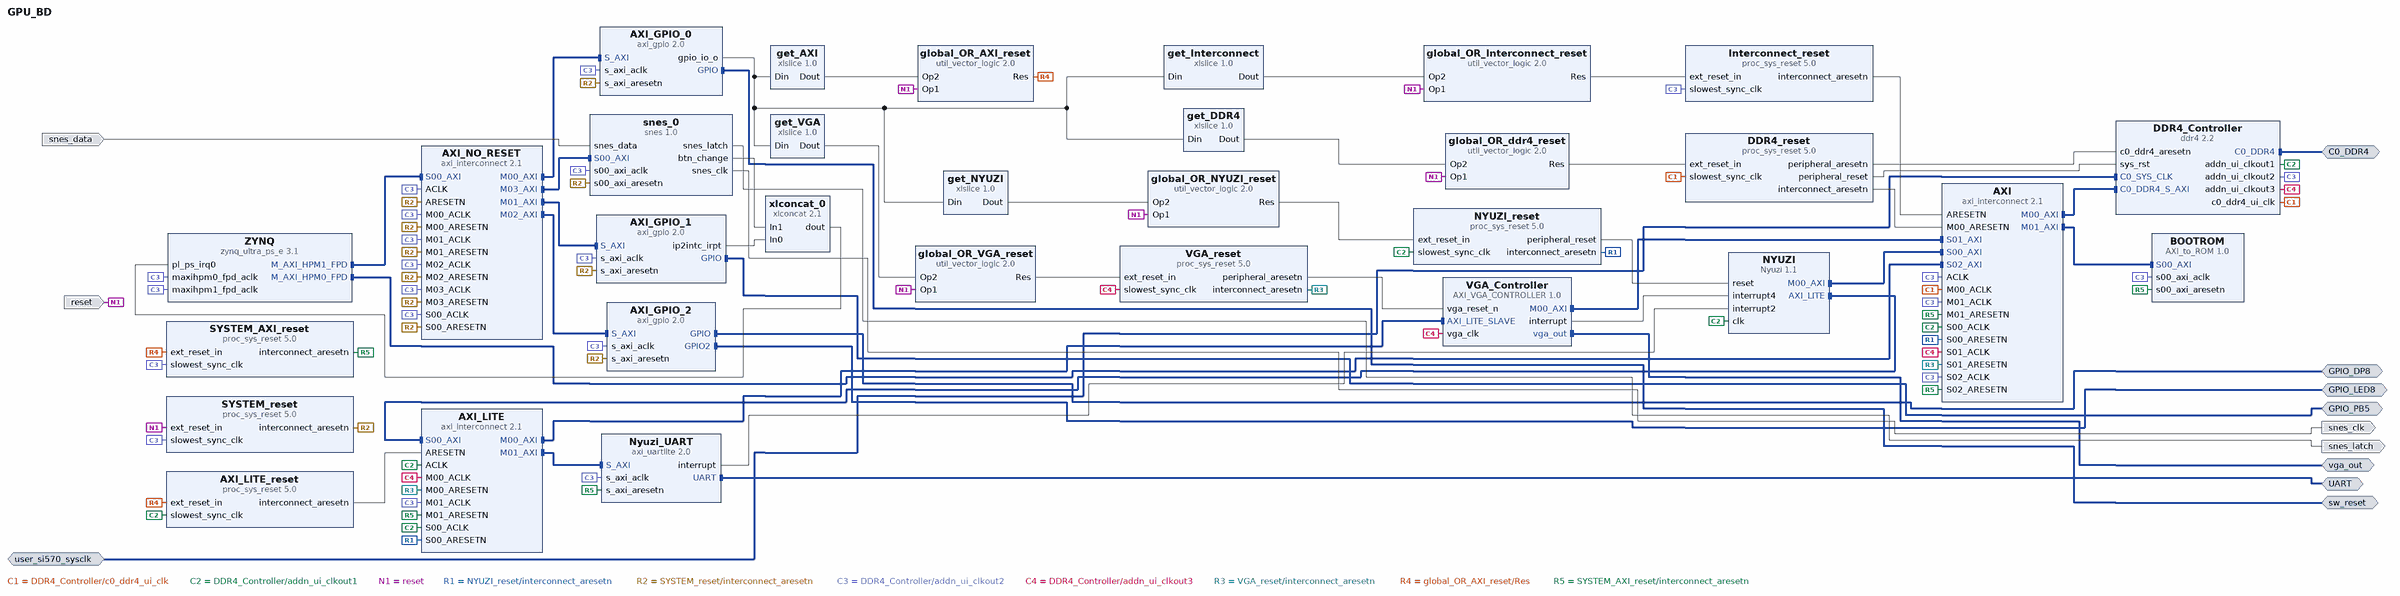
[diagram p0: block diagram of the top level]
# Vivado block design GPU_BD, xczu9eg-ffvb1156-2-e, Vivado 2017.4
create_bd_design GPU_BD

create_bd_intf_port -mode Slave -vlnv xilinx.com:interface:diff_clock_rtl:1.0 user_si570_sysclk
set_property -dict {CONFIG.FREQ_HZ 300000000} [get_bd_intf_ports user_si570_sysclk]
create_bd_intf_port -mode Master -vlnv xilinx.com:interface:ddr4_rtl:1.0 C0_DDR4
create_bd_intf_port -mode Master -vlnv user.org:interface:vga_out_rtl:1.0 vga_out
create_bd_intf_port -mode Master -vlnv xilinx.com:interface:uart_rtl:1.0 UART
create_bd_intf_port -mode Master -vlnv xilinx.com:interface:gpio_rtl:1.0 GPIO_PB5
create_bd_intf_port -mode Master -vlnv xilinx.com:interface:gpio_rtl:1.0 GPIO_DP8
create_bd_intf_port -mode Master -vlnv xilinx.com:interface:gpio_rtl:1.0 GPIO_LED8
create_bd_intf_port -mode Master -vlnv xilinx.com:interface:gpio_rtl:1.0 sw_reset
create_bd_port -dir I -type rst reset
set_property -dict {CONFIG.POLARITY ACTIVE_HIGH} [get_bd_ports reset]
create_bd_port -dir O snes_latch
create_bd_port -dir O snes_clk
create_bd_port -dir I snes_data

create_bd_cell -type ip -vlnv xilinx.com:ip:zynq_ultra_ps_e:3.1 ZYNQ
set_property -dict [list \
  CONFIG.PSU__PSS_REF_CLK__FREQMHZ 33.330 \
  CONFIG.PSU__CAN1__PERIPHERAL__ENABLE 1 \
  CONFIG.PSU__CAN1__PERIPHERAL__IO {MIO 24 .. 25} \
  CONFIG.PSU__DPAUX__PERIPHERAL__ENABLE 1 \
  CONFIG.PSU__DPAUX__PERIPHERAL__IO {MIO 27 .. 30} \
  CONFIG.PSU__GEM__TSU__ENABLE 0 \
  CONFIG.PSU__FPGA_PL0_ENABLE 1 \
  CONFIG.PSU__ENET3__PERIPHERAL__ENABLE 1 \
  CONFIG.PSU__ENET3__FIFO__ENABLE 0 \
  CONFIG.PSU__ENET3__PTP__ENABLE 0 \
  CONFIG.PSU__ENET3__PERIPHERAL__IO {MIO 64 .. 75} \
  CONFIG.PSU__ENET3__GRP_MDIO__ENABLE 1 \
  CONFIG.PSU__ENET3__GRP_MDIO__IO {MIO 76 .. 77} \
  CONFIG.PSU__GPIO0_MIO__PERIPHERAL__ENABLE 1 \
  CONFIG.PSU__GPIO0_MIO__IO {MIO 0 .. 25} \
  CONFIG.PSU__GPIO1_MIO__PERIPHERAL__ENABLE 1 \
  CONFIG.PSU__GPIO1_MIO__IO {MIO 26 .. 51} \
  CONFIG.PSU__I2C0__PERIPHERAL__ENABLE 1 \
  CONFIG.PSU__I2C0__PERIPHERAL__IO {MIO 14 .. 15} \
  CONFIG.PSU__I2C1__PERIPHERAL__ENABLE 1 \
  CONFIG.PSU__I2C1__PERIPHERAL__IO {MIO 16 .. 17} \
  CONFIG.PSU__PCIE__PERIPHERAL__ENABLE 1 \
  CONFIG.PSU__PCIE__PERIPHERAL__ENDPOINT_ENABLE 0 \
  CONFIG.PSU__PCIE__PERIPHERAL__ROOTPORT_ENABLE 1 \
  CONFIG.PSU__PCIE__PERIPHERAL__ROOTPORT_IO {MIO 31} \
  CONFIG.PSU__PCIE__LANE0__ENABLE 1 \
  CONFIG.PSU__PCIE__LANE0__IO {GT Lane0} \
  CONFIG.PSU__GT__LINK_SPEED HBR \
  CONFIG.PSU__GT__VLT_SWNG_LVL_4 0 \
  CONFIG.PSU__GT__PRE_EMPH_LVL_4 0 \
  CONFIG.PSU__USB0__REF_CLK_SEL {Ref Clk2} \
  CONFIG.PSU__USB0__REF_CLK_FREQ 26 \
  CONFIG.PSU__DP__REF_CLK_SEL {Ref Clk3} \
  CONFIG.PSU__DP__REF_CLK_FREQ 27 \
  CONFIG.PSU__SATA__REF_CLK_SEL {Ref Clk1} \
  CONFIG.PSU__SATA__REF_CLK_FREQ 125 \
  CONFIG.PSU__PCIE__REF_CLK_SEL {Ref Clk0} \
  CONFIG.PSU__PCIE__REF_CLK_FREQ 100 \
  CONFIG.PSU__DP__LANE_SEL {Single Lower} \
  CONFIG.PSU__PCIE__DEVICE_PORT_TYPE {Root Port} \
  CONFIG.PSU__PCIE__MAXIMUM_LINK_WIDTH x1 \
  CONFIG.PSU__PCIE__LINK_SPEED {5.0 Gb/s} \
  CONFIG.PSU__PCIE__BAR0_VAL 0x0 \
  CONFIG.PSU__PCIE__BAR1_VAL 0x0 \
  CONFIG.PSU__PCIE__BAR2_VAL 0x0 \
  CONFIG.PSU__PCIE__BAR3_VAL 0x0 \
  CONFIG.PSU__PCIE__BAR4_VAL 0x0 \
  CONFIG.PSU__PCIE__BAR5_VAL 0x0 \
  CONFIG.PSU__PCIE__EROM_VAL 0x0 \
  CONFIG.PSU__PCIE__MAX_PAYLOAD_SIZE {256 bytes} \
  CONFIG.PSU__PCIE__VENDOR_ID 0x10EE \
  CONFIG.PSU__PCIE__DEVICE_ID 0xD021 \
  CONFIG.PSU__PCIE__REVISION_ID 0x0 \
  CONFIG.PSU__PCIE__SUBSYSTEM_VENDOR_ID 0x10EE \
  CONFIG.PSU__PCIE__SUBSYSTEM_ID 0x7 \
  CONFIG.PSU__PCIE__CLASS_CODE_BASE 0x06 \
  CONFIG.PSU__PCIE__CLASS_CODE_SUB 0x4 \
  CONFIG.PSU__PCIE__CLASS_CODE_INTERFACE 0x0 \
  CONFIG.PSU__PCIE__CLASS_CODE_VALUE 0x60400 \
  CONFIG.PSU__PCIE__CRS_SW_VISIBILITY 1 \
  CONFIG.PSU__PMU__AIBACK__ENABLE 0 \
  CONFIG.PSU__PMU__PLERROR__ENABLE 0 \
  CONFIG.PSU__PMU__PERIPHERAL__ENABLE 1 \
  CONFIG.PSU__PMU__EMIO_GPI__ENABLE 0 \
  CONFIG.PSU__PMU__EMIO_GPO__ENABLE 0 \
  CONFIG.PSU__PMU__GPI0__ENABLE 0 \
  CONFIG.PSU__PMU__GPI1__ENABLE 0 \
  CONFIG.PSU__PMU__GPI2__ENABLE 0 \
  CONFIG.PSU__PMU__GPI3__ENABLE 0 \
  CONFIG.PSU__PMU__GPI4__ENABLE 0 \
  CONFIG.PSU__PMU__GPI5__ENABLE 0 \
  CONFIG.PSU__PMU__GPO0__ENABLE 0 \
  CONFIG.PSU__PMU__GPO1__ENABLE 0 \
  CONFIG.PSU__PMU__GPO2__ENABLE 0 \
  CONFIG.PSU__PMU__GPO3__ENABLE 0 \
  CONFIG.PSU__PMU__GPO4__ENABLE 0 \
  CONFIG.PSU__PMU__GPO5__ENABLE 0 \
  CONFIG.PSU__QSPI__PERIPHERAL__ENABLE 1 \
  CONFIG.PSU__QSPI__PERIPHERAL__IO {MIO 0 .. 12} \
  CONFIG.PSU__QSPI__PERIPHERAL__MODE {Dual Parallel} \
  CONFIG.PSU__QSPI__PERIPHERAL__DATA_MODE x4 \
  CONFIG.PSU__QSPI__GRP_FBCLK__ENABLE 1 \
  CONFIG.PSU__QSPI__GRP_FBCLK__IO {MIO 6} \
  CONFIG.PSU__SD1__PERIPHERAL__ENABLE 1 \
  CONFIG.PSU__SD1__PERIPHERAL__IO {MIO 39 .. 51} \
  CONFIG.PSU__SD1__GRP_CD__ENABLE 1 \
  CONFIG.PSU__SD1__GRP_CD__IO {MIO 45} \
  CONFIG.PSU__SD1__GRP_POW__ENABLE 0 \
  CONFIG.PSU__SD1__GRP_WP__ENABLE 1 \
  CONFIG.PSU__SD1__GRP_WP__IO {MIO 44} \
  CONFIG.PSU__SD1__SLOT_TYPE {SD 3.0} \
  CONFIG.PSU__SD1__DATA_TRANSFER_MODE 8Bit \
  CONFIG.PSU__SWDT0__PERIPHERAL__ENABLE 1 \
  CONFIG.PSU__SWDT0__CLOCK__ENABLE 0 \
  CONFIG.PSU__SWDT0__RESET__ENABLE 0 \
  CONFIG.PSU__SWDT1__PERIPHERAL__ENABLE 1 \
  CONFIG.PSU__SWDT1__CLOCK__ENABLE 0 \
  CONFIG.PSU__SWDT1__RESET__ENABLE 0 \
  CONFIG.PSU__UART0__BAUD_RATE 115200 \
  CONFIG.PSU__TTC0__PERIPHERAL__ENABLE 1 \
  CONFIG.PSU__TTC0__CLOCK__ENABLE 0 \
  CONFIG.PSU__TTC0__WAVEOUT__ENABLE 0 \
  CONFIG.PSU__TTC1__PERIPHERAL__ENABLE 1 \
  CONFIG.PSU__UART1__BAUD_RATE 115200 \
  CONFIG.PSU__TTC1__CLOCK__ENABLE 0 \
  CONFIG.PSU__TTC1__WAVEOUT__ENABLE 0 \
  CONFIG.PSU__TTC2__PERIPHERAL__ENABLE 1 \
  CONFIG.PSU__TTC2__CLOCK__ENABLE 0 \
  CONFIG.PSU__TTC2__WAVEOUT__ENABLE 0 \
  CONFIG.PSU__TTC3__PERIPHERAL__ENABLE 1 \
  CONFIG.PSU__TTC3__CLOCK__ENABLE 0 \
  CONFIG.PSU__TTC3__WAVEOUT__ENABLE 0 \
  CONFIG.PSU__CSUPMU__PERIPHERAL__VALID 1 \
  CONFIG.PSU__DDRC__BUS_WIDTH {64 Bit} \
  CONFIG.PSU__DDRC__DEVICE_CAPACITY {4096 MBits} \
  CONFIG.PSU__DDRC__DRAM_WIDTH {8 Bits} \
  CONFIG.PSU__DDRC__ECC Disabled \
  CONFIG.PSU__DDRC__MEMORY_TYPE {DDR 4} \
  CONFIG.PSU__DDRC__SPEED_BIN DDR4_2133P \
  CONFIG.PSU__DDRC__COMPONENTS UDIMM \
  CONFIG.PSU__UART0__PERIPHERAL__ENABLE 1 \
  CONFIG.PSU__UART0__PERIPHERAL__IO {MIO 18 .. 19} \
  CONFIG.PSU__UART0__MODEM__ENABLE 0 \
  CONFIG.PSU__UART1__PERIPHERAL__ENABLE 1 \
  CONFIG.PSU__UART1__PERIPHERAL__IO {MIO 20 .. 21} \
  CONFIG.PSU__UART1__MODEM__ENABLE 0 \
  CONFIG.PSU__USB0__PERIPHERAL__ENABLE 1 \
  CONFIG.PSU__USB0__PERIPHERAL__IO {MIO 52 .. 63} \
  CONFIG.PSU__USB3_0__PERIPHERAL__ENABLE 1 \
  CONFIG.PSU__USB3_0__PERIPHERAL__IO {GT Lane2} \
  CONFIG.PSU__USB3_0__EMIO__ENABLE 0 \
  CONFIG.PSU__USB2_0__EMIO__ENABLE 0 \
  CONFIG.PSU__USE__M_AXI_GP0 1 \
  CONFIG.PSU__MAXIGP0__DATA_WIDTH 128 \
  CONFIG.PSU__USE__M_AXI_GP1 1 \
  CONFIG.PSU__USE__M_AXI_GP2 0 \
  CONFIG.PSU__USE__IRQ0 1 \
  CONFIG.PSU__USE__FABRIC__RST 0 \
  CONFIG.PSU__PRESET_APPLIED 1 \
  CONFIG.PSU__DDR_HIGH_ADDRESS_GUI_ENABLE 1 \
  CONFIG.PSU_BANK_0_IO_STANDARD LVCMOS18 \
  CONFIG.PSU_BANK_1_IO_STANDARD LVCMOS18 \
  CONFIG.PSU_BANK_2_IO_STANDARD LVCMOS18 \
  CONFIG.PSU__DISPLAYPORT__PERIPHERAL__ENABLE 1 \
  CONFIG.PSU__DISPLAYPORT__LANE0__ENABLE 1 \
  CONFIG.PSU__DISPLAYPORT__LANE0__IO {GT Lane1} \
  CONFIG.PSU__DISPLAYPORT__LANE1__ENABLE 0 \
  CONFIG.PSU__SATA__PERIPHERAL__ENABLE 1 \
  CONFIG.PSU__SATA__LANE1__IO {GT Lane3} \
  CONFIG.PSU__CRL_APB__USB3__ENABLE 1 \
  CONFIG.PSU__CRF_APB__APLL_CTRL__SRCSEL PSS_REF_CLK \
  CONFIG.PSU__CRF_APB__DPLL_CTRL__SRCSEL PSS_REF_CLK \
  CONFIG.PSU__CRF_APB__VPLL_CTRL__SRCSEL PSS_REF_CLK \
  CONFIG.PSU__CRF_APB__ACPU_CTRL__SRCSEL APLL \
  CONFIG.PSU__CRF_APB__DBG_TRACE_CTRL__SRCSEL IOPLL \
  CONFIG.PSU__CRF_APB__DBG_FPD_CTRL__SRCSEL IOPLL \
  CONFIG.PSU__CRF_APB__DP_VIDEO_REF_CTRL__SRCSEL VPLL \
  CONFIG.PSU__CRF_APB__DP_AUDIO_REF_CTRL__SRCSEL RPLL \
  CONFIG.PSU__CRF_APB__DP_STC_REF_CTRL__SRCSEL RPLL \
  CONFIG.PSU__CRF_APB__DDR_CTRL__SRCSEL DPLL \
  CONFIG.PSU__CRF_APB__GPU_REF_CTRL__SRCSEL IOPLL \
  CONFIG.PSU__CRL_APB__PL0_REF_CTRL__SRCSEL IOPLL \
  CONFIG.PSU__CRF_APB__GDMA_REF_CTRL__SRCSEL APLL \
  CONFIG.PSU__CRF_APB__DPDMA_REF_CTRL__SRCSEL APLL \
  CONFIG.PSU__CRF_APB__TOPSW_MAIN_CTRL__SRCSEL DPLL \
  CONFIG.PSU__CRF_APB__TOPSW_LSBUS_CTRL__SRCSEL IOPLL \
  CONFIG.PSU__CRF_APB__DBG_TSTMP_CTRL__SRCSEL IOPLL \
  CONFIG.PSU__CRL_APB__IOPLL_CTRL__SRCSEL PSS_REF_CLK \
  CONFIG.PSU__CRL_APB__RPLL_CTRL__SRCSEL PSS_REF_CLK \
  CONFIG.PSU__CRL_APB__GEM3_REF_CTRL__SRCSEL IOPLL \
  CONFIG.PSU__CRL_APB__USB0_BUS_REF_CTRL__SRCSEL IOPLL \
  CONFIG.PSU__CRL_APB__QSPI_REF_CTRL__SRCSEL IOPLL \
  CONFIG.PSU__CRL_APB__SDIO1_REF_CTRL__SRCSEL IOPLL \
  CONFIG.PSU__CRL_APB__UART0_REF_CTRL__SRCSEL IOPLL \
  CONFIG.PSU__CRL_APB__UART1_REF_CTRL__SRCSEL IOPLL \
  CONFIG.PSU__CRL_APB__I2C0_REF_CTRL__SRCSEL IOPLL \
  CONFIG.PSU__CRL_APB__I2C1_REF_CTRL__SRCSEL IOPLL \
  CONFIG.PSU__CRL_APB__CAN1_REF_CTRL__SRCSEL IOPLL \
  CONFIG.PSU__CRL_APB__CPU_R5_CTRL__SRCSEL IOPLL \
  CONFIG.PSU__CRL_APB__IOU_SWITCH_CTRL__SRCSEL IOPLL \
  CONFIG.PSU__CRL_APB__PCAP_CTRL__SRCSEL IOPLL \
  CONFIG.PSU__CRL_APB__LPD_LSBUS_CTRL__SRCSEL IOPLL \
  CONFIG.PSU__CRL_APB__LPD_SWITCH_CTRL__SRCSEL IOPLL \
  CONFIG.PSU__CRL_APB__DBG_LPD_CTRL__SRCSEL IOPLL \
  CONFIG.PSU__CRL_APB__ADMA_REF_CTRL__SRCSEL IOPLL \
  CONFIG.PSU__CRL_APB__TIMESTAMP_REF_CTRL__SRCSEL IOPLL \
  CONFIG.PSU__CRL_APB__USB3_DUAL_REF_CTRL__SRCSEL IOPLL \
  CONFIG.PSU__IOU_SLCR__IOU_TTC_APB_CLK__TTC0_SEL APB \
  CONFIG.PSU__IOU_SLCR__IOU_TTC_APB_CLK__TTC1_SEL APB \
  CONFIG.PSU__IOU_SLCR__IOU_TTC_APB_CLK__TTC2_SEL APB \
  CONFIG.PSU__IOU_SLCR__IOU_TTC_APB_CLK__TTC3_SEL APB \
  CONFIG.PSU__OVERRIDE__BASIC_CLOCK 0 \
  CONFIG.PSU__DLL__ISUSED 1 \
  CONFIG.PSU__DDR__INTERFACE__FREQMHZ 533.500 \
  CONFIG.PSU__CRF_APB__ACPU_CTRL__FREQMHZ 1200 \
  CONFIG.PSU__CRF_APB__DBG_TRACE_CTRL__FREQMHZ 250 \
  CONFIG.PSU__CRF_APB__DBG_FPD_CTRL__FREQMHZ 250 \
  CONFIG.PSU__CRF_APB__DDR_CTRL__FREQMHZ 1067 \
  CONFIG.PSU__CRF_APB__GPU_REF_CTRL__FREQMHZ 500 \
  CONFIG.PSU__CRL_APB__PL0_REF_CTRL__FREQMHZ 100 \
  CONFIG.PSU__CRF_APB__GDMA_REF_CTRL__FREQMHZ 600 \
  CONFIG.PSU__CRF_APB__DPDMA_REF_CTRL__FREQMHZ 600 \
  CONFIG.PSU__CRF_APB__TOPSW_MAIN_CTRL__FREQMHZ 533.33 \
  CONFIG.PSU__CRF_APB__TOPSW_LSBUS_CTRL__FREQMHZ 100 \
  CONFIG.PSU__CRF_APB__DBG_TSTMP_CTRL__FREQMHZ 250 \
  CONFIG.PSU__CRL_APB__GEM3_REF_CTRL__FREQMHZ 125 \
  CONFIG.PSU__CRL_APB__USB0_BUS_REF_CTRL__FREQMHZ 250 \
  CONFIG.PSU__CRL_APB__QSPI_REF_CTRL__FREQMHZ 125 \
  CONFIG.PSU__CRL_APB__SDIO1_REF_CTRL__FREQMHZ 200 \
  CONFIG.PSU__CRL_APB__UART0_REF_CTRL__FREQMHZ 100 \
  CONFIG.PSU__CRL_APB__UART1_REF_CTRL__FREQMHZ 100 \
  CONFIG.PSU__CRL_APB__I2C0_REF_CTRL__FREQMHZ 100 \
  CONFIG.PSU__CRL_APB__I2C1_REF_CTRL__FREQMHZ 100 \
  CONFIG.PSU__CRL_APB__CAN1_REF_CTRL__FREQMHZ 100 \
  CONFIG.PSU__CRL_APB__CPU_R5_CTRL__FREQMHZ 500 \
  CONFIG.PSU__CRL_APB__IOU_SWITCH_CTRL__FREQMHZ 250 \
  CONFIG.PSU__CRL_APB__PCAP_CTRL__FREQMHZ 200 \
  CONFIG.PSU__CRL_APB__LPD_LSBUS_CTRL__FREQMHZ 100 \
  CONFIG.PSU__CRL_APB__LPD_SWITCH_CTRL__FREQMHZ 500 \
  CONFIG.PSU__CRL_APB__DBG_LPD_CTRL__FREQMHZ 250 \
  CONFIG.PSU__CRL_APB__ADMA_REF_CTRL__FREQMHZ 500 \
  CONFIG.PSU__CRL_APB__TIMESTAMP_REF_CTRL__FREQMHZ 100 \
  CONFIG.PSU__CRL_APB__USB3_DUAL_REF_CTRL__FREQMHZ 20 \
  CONFIG.PSU__GPIO_EMIO__WIDTH {[95:0]} \
  CONFIG.PSU__PMU_COHERENCY 0 \
  CONFIG.PSU__USB0_COHERENCY 0 \
  CONFIG.PSU__SD1_COHERENCY 0 \
  CONFIG.PSU__QSPI_COHERENCY 0 \
  CONFIG.PSU__ENET3__TSU__ENABLE 0 \
  CONFIG.PSU__GEM3_COHERENCY 0 \
] [get_bd_cells ZYNQ]
# 100 more settings of ZYNQ are not shown: defaults, MIO pin electricals, DDR timing, and values the tool derives
create_bd_cell -type ip -vlnv user.org:user:Nyuzi:1.1 NYUZI
set_property -dict [list \
  CONFIG.C_M00_AXI_TARGET_SLAVE_BASE_ADDR 0x0000000400000000 \
  CONFIG.C_M00_AXI_ID_WIDTH 2 \
  CONFIG.C_M00_AXI_ADDR_WIDTH 40 \
  CONFIG.C_M00_AXI_AWUSER_WIDTH 2 \
  CONFIG.C_M00_AXI_ARUSER_WIDTH 2 \
  CONFIG.C_M00_AXI_WUSER_WIDTH 2 \
  CONFIG.C_M00_AXI_RUSER_WIDTH 2 \
  CONFIG.C_M00_AXI_BUSER_WIDTH 2 \
  CONFIG.NUM_INTERRUPTS 5 \
] [get_bd_cells NYUZI]
create_bd_cell -type ip -vlnv user:user:AXI_VGA_CONTROLLER:1.0 VGA_Controller
set_property -dict [list \
  CONFIG.C_M00_AXI_TARGET_SLAVE_BASE_ADDR 0x0000000400000000 \
  CONFIG.C_M00_AXI_ID_WIDTH 2 \
  CONFIG.C_M00_AXI_AWUSER_WIDTH 2 \
  CONFIG.C_M00_AXI_ARUSER_WIDTH 2 \
  CONFIG.C_M00_AXI_WUSER_WIDTH 2 \
  CONFIG.C_M00_AXI_RUSER_WIDTH 2 \
  CONFIG.C_M00_AXI_BUSER_WIDTH 2 \
] [get_bd_cells VGA_Controller]
create_bd_cell -type ip -vlnv xilinx.com:ip:axi_interconnect:2.1 AXI
set_property -dict {CONFIG.NUM_SI 3 CONFIG.NUM_MI 2} [get_bd_cells AXI]
create_bd_cell -type ip -vlnv user.org:user:AXI_to_ROM:1.0 BOOTROM
set_property -dict [list \
  CONFIG.BASE_ADDRESS 0xFFFEE000 \
  CONFIG.ROM_ADDR_WIDTH 12 \
  CONFIG.ROM_HEX_FILE /home/johannes/Dokumente/GPU_Project/repo/nyuzi-soc/sw/nyuzi_sw/software/bootrom/boot.hex \
] [get_bd_cells BOOTROM]
create_bd_cell -type ip -vlnv xilinx.com:ip:axi_gpio:2.0 AXI_GPIO_1
set_property -dict {CONFIG.C_INTERRUPT_PRESENT 1 CONFIG.GPIO_BOARD_INTERFACE push_buttons_5bits} [get_bd_cells AXI_GPIO_1]
create_bd_cell -type ip -vlnv xilinx.com:ip:axi_gpio:2.0 AXI_GPIO_2
set_property -dict [list \
  CONFIG.GPIO_BOARD_INTERFACE dip_switches_8bits \
  CONFIG.GPIO2_BOARD_INTERFACE led_8bits \
] [get_bd_cells AXI_GPIO_2]
create_bd_cell -type ip -vlnv xilinx.com:ip:axi_gpio:2.0 AXI_GPIO_0
set_property -dict [list \
  CONFIG.C_GPIO_WIDTH 5 \
  CONFIG.C_IS_DUAL 0 \
  CONFIG.C_DOUT_DEFAULT 0x00000002 \
  CONFIG.C_ALL_OUTPUTS 1 \
] [get_bd_cells AXI_GPIO_0]
create_bd_cell -type ip -vlnv xilinx.com:ip:axi_uartlite:2.0 Nyuzi_UART
set_property -dict {CONFIG.C_BAUDRATE 9600} [get_bd_cells Nyuzi_UART]
create_bd_cell -type ip -vlnv xilinx.com:ip:axi_interconnect:2.1 AXI_LITE
create_bd_cell -type ip -vlnv xilinx.com:ip:proc_sys_reset:5.0 NYUZI_reset
create_bd_cell -type ip -vlnv xilinx.com:ip:proc_sys_reset:5.0 VGA_reset
create_bd_cell -type ip -vlnv xilinx.com:ip:proc_sys_reset:5.0 DDR4_reset
create_bd_cell -type ip -vlnv xilinx.com:ip:ddr4:2.2 DDR4_Controller
set_property -dict [list \
  CONFIG.RESET_BOARD_INTERFACE reset \
  CONFIG.C0_CLOCK_BOARD_INTERFACE user_si570_sysclk \
  CONFIG.C0_DDR4_BOARD_INTERFACE ddr4_sdram \
  CONFIG.ADDN_UI_CLKOUT1_FREQ_HZ 115 \
  CONFIG.ADDN_UI_CLKOUT2_FREQ_HZ 100 \
  CONFIG.ADDN_UI_CLKOUT3_FREQ_HZ 50 \
  CONFIG.C0.BANK_GROUP_WIDTH 1 \
] [get_bd_cells DDR4_Controller]
create_bd_cell -type ip -vlnv xilinx.com:ip:util_vector_logic:2.0 global_OR_NYUZI_reset
set_property -dict {CONFIG.C_SIZE 1 CONFIG.C_OPERATION or} [get_bd_cells global_OR_NYUZI_reset]
create_bd_cell -type ip -vlnv xilinx.com:ip:proc_sys_reset:5.0 SYSTEM_reset
create_bd_cell -type ip -vlnv xilinx.com:ip:proc_sys_reset:5.0 AXI_LITE_reset
create_bd_cell -type ip -vlnv xilinx.com:ip:util_vector_logic:2.0 global_OR_AXI_reset
set_property -dict {CONFIG.C_SIZE 1 CONFIG.C_OPERATION or} [get_bd_cells global_OR_AXI_reset]
create_bd_cell -type ip -vlnv xilinx.com:ip:proc_sys_reset:5.0 SYSTEM_AXI_reset
create_bd_cell -type ip -vlnv xilinx.com:ip:axi_interconnect:2.1 AXI_NO_RESET
set_property -dict {CONFIG.NUM_MI 4} [get_bd_cells AXI_NO_RESET]
create_bd_cell -type ip -vlnv xilinx.com:ip:util_vector_logic:2.0 global_OR_ddr4_reset
set_property -dict {CONFIG.C_SIZE 1 CONFIG.C_OPERATION or} [get_bd_cells global_OR_ddr4_reset]
create_bd_cell -type ip -vlnv xilinx.com:ip:xlslice:1.0 get_NYUZI
set_property -dict {CONFIG.DIN_TO 1 CONFIG.DIN_FROM 1 CONFIG.DIN_WIDTH 5 CONFIG.DOUT_WIDTH 1} [get_bd_cells get_NYUZI]
create_bd_cell -type ip -vlnv xilinx.com:ip:xlslice:1.0 get_DDR4
set_property -dict {CONFIG.DIN_TO 0 CONFIG.DIN_FROM 0 CONFIG.DIN_WIDTH 5 CONFIG.DOUT_WIDTH 1} [get_bd_cells get_DDR4]
create_bd_cell -type ip -vlnv xilinx.com:ip:util_vector_logic:2.0 global_OR_VGA_reset
set_property -dict {CONFIG.C_SIZE 1 CONFIG.C_OPERATION or} [get_bd_cells global_OR_VGA_reset]
create_bd_cell -type ip -vlnv xilinx.com:ip:xlslice:1.0 get_VGA
set_property -dict {CONFIG.DIN_TO 3 CONFIG.DIN_FROM 3 CONFIG.DIN_WIDTH 5 CONFIG.DOUT_WIDTH 1} [get_bd_cells get_VGA]
create_bd_cell -type ip -vlnv xilinx.com:ip:xlslice:1.0 get_AXI
set_property -dict {CONFIG.DIN_TO 2 CONFIG.DIN_FROM 2 CONFIG.DIN_WIDTH 5 CONFIG.DOUT_WIDTH 1} [get_bd_cells get_AXI]
create_bd_cell -type ip -vlnv xilinx.com:ip:util_vector_logic:2.0 global_OR_Interconnect_reset
set_property -dict {CONFIG.C_SIZE 1 CONFIG.C_OPERATION or} [get_bd_cells global_OR_Interconnect_reset]
create_bd_cell -type ip -vlnv xilinx.com:ip:xlslice:1.0 get_Interconnect
set_property -dict {CONFIG.DIN_TO 4 CONFIG.DIN_FROM 4 CONFIG.DIN_WIDTH 5 CONFIG.DOUT_WIDTH 1} [get_bd_cells get_Interconnect]
create_bd_cell -type ip -vlnv xilinx.com:ip:proc_sys_reset:5.0 Interconnect_reset
create_bd_cell -type ip -vlnv xilinx.com:ip:xlconcat:2.1 xlconcat_0
create_bd_cell -type ip -vlnv user.org:user:snes:1.0 snes_0
set_property -dict {CONFIG.C_S00_AXI_CLK_SPEED_MHZ 100} [get_bd_cells snes_0]

# ---- connections ----

connect_bd_intf_net [get_bd_intf_pins AXI/M00_AXI] [get_bd_intf_pins DDR4_Controller/C0_DDR4_S_AXI]
connect_bd_intf_net [get_bd_intf_pins AXI/M01_AXI] [get_bd_intf_pins BOOTROM/S00_AXI]
connect_bd_intf_net [get_bd_intf_pins NYUZI/M00_AXI] [get_bd_intf_pins AXI/S00_AXI]
connect_bd_intf_net [get_bd_intf_pins ZYNQ/M_AXI_HPM0_FPD] [get_bd_intf_pins AXI/S02_AXI]
connect_bd_intf_net [get_bd_intf_pins AXI_LITE/M00_AXI] [get_bd_intf_pins VGA_Controller/AXI_LITE_SLAVE]
connect_bd_intf_net [get_bd_intf_pins AXI_LITE/M01_AXI] [get_bd_intf_pins Nyuzi_UART/S_AXI]
connect_bd_intf_net [get_bd_intf_pins NYUZI/AXI_LITE] [get_bd_intf_pins AXI_LITE/S00_AXI]
connect_bd_intf_net [get_bd_intf_pins VGA_Controller/M00_AXI] [get_bd_intf_pins AXI/S01_AXI]
connect_bd_intf_net [get_bd_intf_pins ZYNQ/M_AXI_HPM1_FPD] [get_bd_intf_pins AXI_NO_RESET/S00_AXI]
connect_bd_intf_net -intf_net axi_interconnect_0_M00_AXI [get_bd_intf_pins AXI_NO_RESET/M00_AXI] [get_bd_intf_pins AXI_GPIO_0/S_AXI]
connect_bd_intf_net [get_bd_intf_pins AXI_GPIO_1/S_AXI] [get_bd_intf_pins AXI_NO_RESET/M01_AXI]
connect_bd_intf_net [get_bd_intf_pins AXI_GPIO_2/S_AXI] [get_bd_intf_pins AXI_NO_RESET/M02_AXI]
connect_bd_intf_net [get_bd_intf_pins AXI_NO_RESET/M03_AXI] [get_bd_intf_pins snes_0/S00_AXI]
connect_bd_intf_net [get_bd_intf_ports user_si570_sysclk] [get_bd_intf_pins DDR4_Controller/C0_SYS_CLK]
connect_bd_intf_net -intf_net ddr4_0_C0_DDR4 [get_bd_intf_ports C0_DDR4] [get_bd_intf_pins DDR4_Controller/C0_DDR4]
connect_bd_intf_net [get_bd_intf_ports vga_out] [get_bd_intf_pins VGA_Controller/vga_out]
connect_bd_intf_net [get_bd_intf_ports UART] [get_bd_intf_pins Nyuzi_UART/UART]
connect_bd_intf_net -intf_net GPIO_0_GPIO [get_bd_intf_ports GPIO_PB5] [get_bd_intf_pins AXI_GPIO_1/GPIO]
connect_bd_intf_net -intf_net GPIO_1_GPIO [get_bd_intf_ports GPIO_DP8] [get_bd_intf_pins AXI_GPIO_2/GPIO]
connect_bd_intf_net -intf_net GPIO_1_GPIO2 [get_bd_intf_ports GPIO_LED8] [get_bd_intf_pins AXI_GPIO_2/GPIO2]
connect_bd_intf_net -intf_net GPIO_2_GPIO [get_bd_intf_ports sw_reset] [get_bd_intf_pins AXI_GPIO_0/GPIO]
connect_bd_net [get_bd_pins DDR4_Controller/c0_ddr4_ui_clk] [get_bd_pins DDR4_reset/slowest_sync_clk] [get_bd_pins AXI/M00_ACLK]
connect_bd_net [get_bd_pins DDR4_Controller/addn_ui_clkout1] \
  [get_bd_pins NYUZI/clk] [get_bd_pins NYUZI_reset/slowest_sync_clk] [get_bd_pins AXI_LITE_reset/slowest_sync_clk] \
  [get_bd_pins AXI/S00_ACLK] [get_bd_pins AXI_LITE/ACLK] [get_bd_pins AXI_LITE/S00_ACLK]
connect_bd_net [get_bd_pins VGA_Controller/interrupt] [get_bd_pins NYUZI/interrupt4]
connect_bd_net [get_bd_pins Nyuzi_UART/interrupt] [get_bd_pins NYUZI/interrupt2]
connect_bd_net [get_bd_pins DDR4_reset/peripheral_aresetn] [get_bd_pins DDR4_Controller/c0_ddr4_aresetn]
connect_bd_net [get_bd_pins DDR4_reset/peripheral_reset] [get_bd_pins DDR4_Controller/sys_rst]
connect_bd_net [get_bd_ports reset] \
  [get_bd_pins global_OR_AXI_reset/Op1] [get_bd_pins global_OR_NYUZI_reset/Op1] [get_bd_pins SYSTEM_reset/ext_reset_in] \
  [get_bd_pins global_OR_ddr4_reset/Op1] [get_bd_pins global_OR_VGA_reset/Op1] [get_bd_pins global_OR_Interconnect_reset/Op1]
connect_bd_net [get_bd_pins NYUZI_reset/interconnect_aresetn] [get_bd_pins AXI/S00_ARESETN] [get_bd_pins AXI_LITE/S00_ARESETN]
connect_bd_net -net M01_ARESETN_1 [get_bd_pins SYSTEM_reset/interconnect_aresetn] \
  [get_bd_pins AXI_GPIO_2/s_axi_aresetn] [get_bd_pins AXI_GPIO_1/s_axi_aresetn] [get_bd_pins AXI_GPIO_0/s_axi_aresetn] \
  [get_bd_pins snes_0/s00_axi_aresetn] [get_bd_pins AXI_NO_RESET/M00_ARESETN] [get_bd_pins AXI_NO_RESET/S00_ARESETN] \
  [get_bd_pins AXI_NO_RESET/ARESETN] [get_bd_pins AXI_NO_RESET/M01_ARESETN] [get_bd_pins AXI_NO_RESET/M02_ARESETN] \
  [get_bd_pins AXI_NO_RESET/M03_ARESETN]
connect_bd_net [get_bd_pins DDR4_Controller/addn_ui_clkout2] \
  [get_bd_pins BOOTROM/s00_axi_aclk] [get_bd_pins AXI_GPIO_1/s_axi_aclk] [get_bd_pins AXI_GPIO_2/s_axi_aclk] \
  [get_bd_pins AXI_GPIO_0/s_axi_aclk] [get_bd_pins SYSTEM_reset/slowest_sync_clk] [get_bd_pins ZYNQ/maxihpm0_fpd_aclk] \
  [get_bd_pins Nyuzi_UART/s_axi_aclk] [get_bd_pins SYSTEM_AXI_reset/slowest_sync_clk] [get_bd_pins ZYNQ/maxihpm1_fpd_aclk] \
  [get_bd_pins Interconnect_reset/slowest_sync_clk] [get_bd_pins snes_0/s00_axi_aclk] [get_bd_pins AXI/M01_ACLK] \
  [get_bd_pins AXI/S02_ACLK] [get_bd_pins AXI/ACLK] [get_bd_pins AXI_LITE/M01_ACLK] [get_bd_pins AXI_NO_RESET/ACLK] \
  [get_bd_pins AXI_NO_RESET/M00_ACLK] [get_bd_pins AXI_NO_RESET/S00_ACLK] [get_bd_pins AXI_NO_RESET/M01_ACLK] \
  [get_bd_pins AXI_NO_RESET/M02_ACLK] [get_bd_pins AXI_NO_RESET/M03_ACLK]
connect_bd_net [get_bd_pins DDR4_reset/interconnect_aresetn] [get_bd_pins AXI/M00_ARESETN]
connect_bd_net [get_bd_pins DDR4_Controller/addn_ui_clkout3] \
  [get_bd_pins VGA_Controller/vga_clk] [get_bd_pins VGA_reset/slowest_sync_clk] [get_bd_pins AXI/S01_ACLK] \
  [get_bd_pins AXI_LITE/M00_ACLK]
connect_bd_net [get_bd_pins VGA_reset/interconnect_aresetn] [get_bd_pins AXI/S01_ARESETN] [get_bd_pins AXI_LITE/M00_ARESETN]
connect_bd_net [get_bd_pins VGA_reset/peripheral_aresetn] [get_bd_pins VGA_Controller/vga_reset_n]
connect_bd_net -net NYUZI_reset_OR_global_reset_Res [get_bd_pins global_OR_NYUZI_reset/Res] [get_bd_pins NYUZI_reset/ext_reset_in]
connect_bd_net -net ARESETN_1 [get_bd_pins AXI_LITE_reset/interconnect_aresetn] [get_bd_pins AXI_LITE/ARESETN]
connect_bd_net -net sw_reset_OR_global_reset_Res [get_bd_pins global_OR_AXI_reset/Res] \
  [get_bd_pins AXI_LITE_reset/ext_reset_in] [get_bd_pins SYSTEM_AXI_reset/ext_reset_in]
connect_bd_net [get_bd_pins NYUZI_reset/peripheral_reset] [get_bd_pins NYUZI/reset]
connect_bd_net -net M01_ARESETN_2 [get_bd_pins SYSTEM_AXI_reset/interconnect_aresetn] \
  [get_bd_pins BOOTROM/s00_axi_aresetn] [get_bd_pins Nyuzi_UART/s_axi_aresetn] [get_bd_pins AXI_LITE/M01_ARESETN] \
  [get_bd_pins AXI/S02_ARESETN] [get_bd_pins AXI/M01_ARESETN]
connect_bd_net -net sw_reset_OR_global_reset1_Res [get_bd_pins global_OR_ddr4_reset/Res] [get_bd_pins DDR4_reset/ext_reset_in]
connect_bd_net -net AXI_GPIO_2_gpio_io_o [get_bd_pins AXI_GPIO_0/gpio_io_o] \
  [get_bd_pins get_NYUZI/Din] [get_bd_pins get_DDR4/Din] [get_bd_pins get_VGA/Din] [get_bd_pins get_AXI/Din] \
  [get_bd_pins get_Interconnect/Din]
connect_bd_net [get_bd_pins get_NYUZI/Dout] [get_bd_pins global_OR_NYUZI_reset/Op2]
connect_bd_net -net get_NYUZI1_Dout [get_bd_pins get_DDR4/Dout] [get_bd_pins global_OR_ddr4_reset/Op2]
connect_bd_net -net get_NYUZI1_Dout1 [get_bd_pins get_VGA/Dout] [get_bd_pins global_OR_VGA_reset/Op2]
connect_bd_net -net sw_reset_OR_global_reset1_Res1 [get_bd_pins global_OR_VGA_reset/Res] [get_bd_pins VGA_reset/ext_reset_in]
connect_bd_net -net get_VGA1_Dout [get_bd_pins get_AXI/Dout] [get_bd_pins global_OR_AXI_reset/Op2]
connect_bd_net [get_bd_pins get_Interconnect/Dout] [get_bd_pins global_OR_Interconnect_reset/Op2]
connect_bd_net [get_bd_pins global_OR_Interconnect_reset/Res] [get_bd_pins Interconnect_reset/ext_reset_in]
connect_bd_net [get_bd_pins Interconnect_reset/interconnect_aresetn] [get_bd_pins AXI/ARESETN]
connect_bd_net [get_bd_pins snes_0/snes_latch] [get_bd_ports snes_latch]
connect_bd_net [get_bd_pins snes_0/snes_clk] [get_bd_ports snes_clk]
connect_bd_net -net snes_data_0_1 [get_bd_ports snes_data] [get_bd_pins snes_0/snes_data]
connect_bd_net [get_bd_pins AXI_GPIO_1/ip2intc_irpt] [get_bd_pins xlconcat_0/In0]
connect_bd_net [get_bd_pins xlconcat_0/dout] [get_bd_pins ZYNQ/pl_ps_irq0]
connect_bd_net [get_bd_pins snes_0/btn_change] [get_bd_pins xlconcat_0/In1]

# ---- address map ----
assign_bd_address -offset 0x00001000 -range 4K -target_address_space [get_bd_addr_spaces NYUZI/AXI_LITE] [get_bd_addr_segs VGA_Controller/AXI_LITE_SLAVE/reg0]
assign_bd_address -offset 0x00002000 -range 4K -target_address_space [get_bd_addr_spaces NYUZI/AXI_LITE] [get_bd_addr_segs Nyuzi_UART/S_AXI/Reg]
assign_bd_address -offset 0x00A0000000 -range 4K -target_address_space [get_bd_addr_spaces NYUZI/M00_AXI] [get_bd_addr_segs snes_0/S00_AXI/S00_AXI_reg]
assign_bd_address -offset 0x0400000000 -range 512M -target_address_space [get_bd_addr_spaces NYUZI/M00_AXI] [get_bd_addr_segs DDR4_Controller/C0_DDR4_MEMORY_MAP/C0_DDR4_ADDRESS_BLOCK]
assign_bd_address -offset 0x04A0010000 -range 4K -target_address_space [get_bd_addr_spaces NYUZI/M00_AXI] [get_bd_addr_segs AXI_GPIO_1/S_AXI/Reg]
assign_bd_address -offset 0x04A0011000 -range 4K -target_address_space [get_bd_addr_spaces NYUZI/M00_AXI] [get_bd_addr_segs AXI_GPIO_2/S_AXI/Reg]
assign_bd_address -offset 0x04A0012000 -range 4K -target_address_space [get_bd_addr_spaces NYUZI/M00_AXI] [get_bd_addr_segs AXI_GPIO_0/S_AXI/Reg]
assign_bd_address -offset 0x04FFFEE000 -range 4K -target_address_space [get_bd_addr_spaces NYUZI/M00_AXI] [get_bd_addr_segs BOOTROM/S00_AXI/S00_AXI_reg]
assign_bd_address -offset 0x0400000000 -range 512M -target_address_space [get_bd_addr_spaces VGA_Controller/M00_AXI] [get_bd_addr_segs DDR4_Controller/C0_DDR4_MEMORY_MAP/C0_DDR4_ADDRESS_BLOCK]
exclude_bd_addr_seg -offset 0x04FFFEE000 -range 4K -target_address_space [get_bd_addr_spaces VGA_Controller/M00_AXI] [get_bd_addr_segs BOOTROM/S00_AXI/S00_AXI_reg]
assign_bd_address -offset 0x00400000000 -range 512M -target_address_space [get_bd_addr_spaces ZYNQ/Data] [get_bd_addr_segs DDR4_Controller/C0_DDR4_MEMORY_MAP/C0_DDR4_ADDRESS_BLOCK]
assign_bd_address -offset 0x004FFFEE000 -range 4K -target_address_space [get_bd_addr_spaces ZYNQ/Data] [get_bd_addr_segs BOOTROM/S00_AXI/S00_AXI_reg]
assign_bd_address -offset 0x005A0010000 -range 4K -target_address_space [get_bd_addr_spaces ZYNQ/Data] [get_bd_addr_segs AXI_GPIO_1/S_AXI/Reg]
assign_bd_address -offset 0x005A0011000 -range 4K -target_address_space [get_bd_addr_spaces ZYNQ/Data] [get_bd_addr_segs AXI_GPIO_2/S_AXI/Reg]
assign_bd_address -offset 0x005A0012000 -range 4K -target_address_space [get_bd_addr_spaces ZYNQ/Data] [get_bd_addr_segs AXI_GPIO_0/S_AXI/Reg]
assign_bd_address -offset 0x005A0013000 -range 4K -target_address_space [get_bd_addr_spaces ZYNQ/Data] [get_bd_addr_segs snes_0/S00_AXI/S00_AXI_reg]

validate_bd_design
save_bd_design
